# Altium project PT-PWR-EPS-002_v1.PrjPcb (part 3 of 5)

## Sheet [03] - CONNECTORS.SchDoc
size A4; DocumentNumber: 3; SheetNumber: 3; SheetTotal: 12
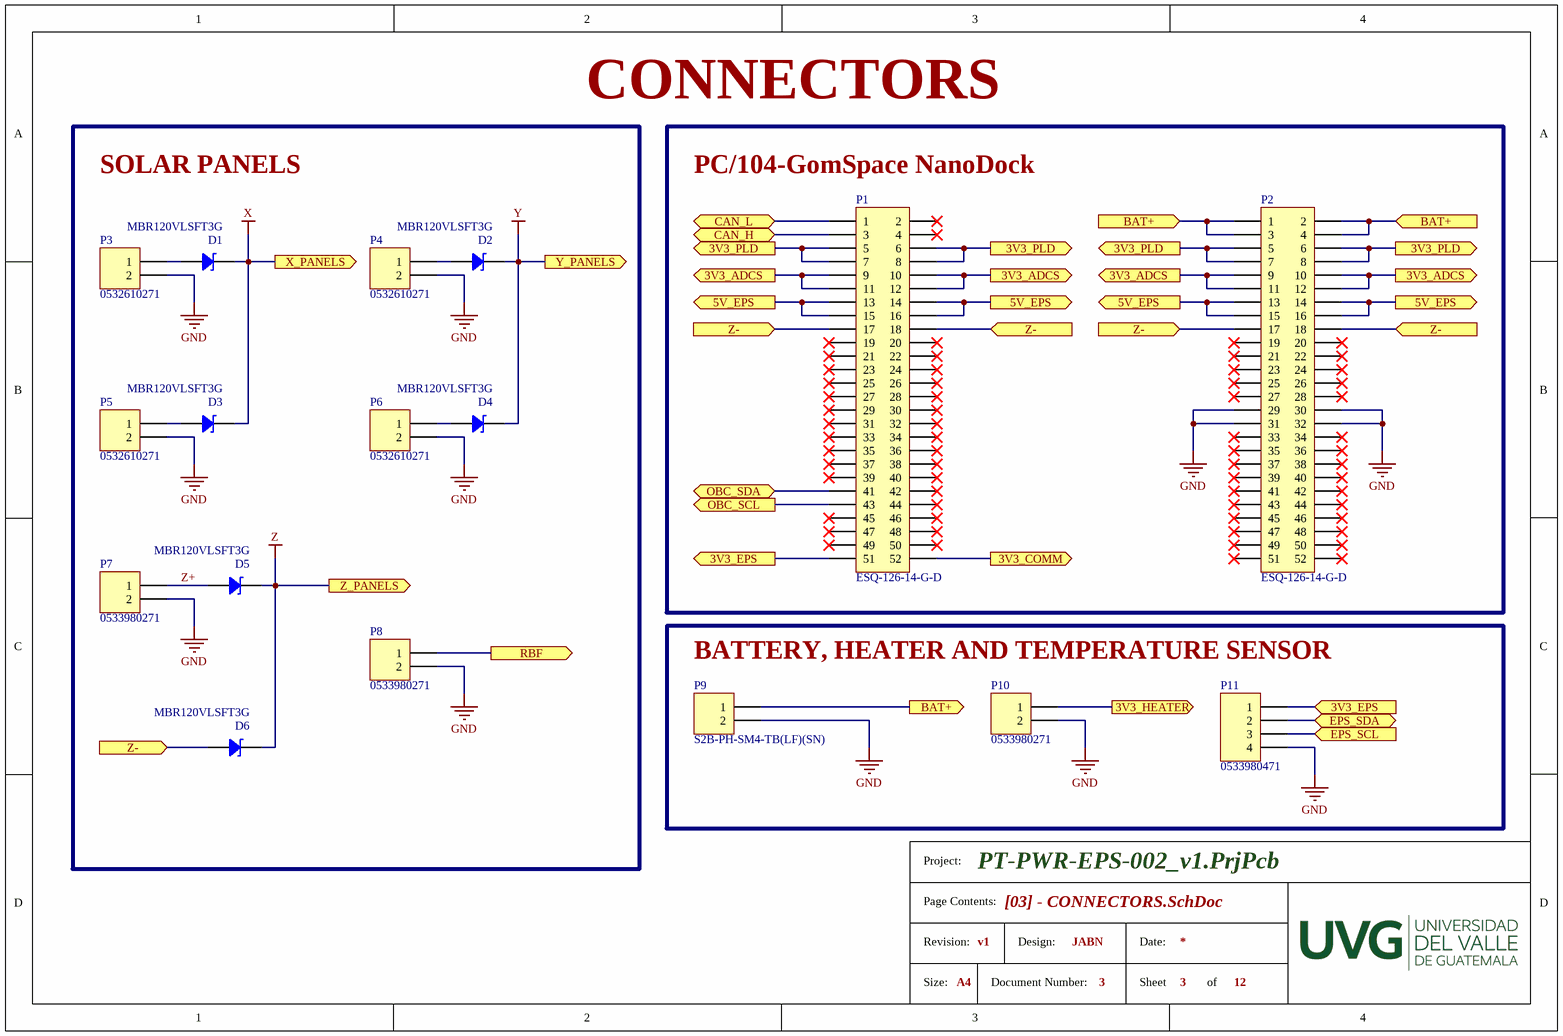
[diagram p5: [03] - CONNECTORS.SchDoc]

### Parts
D1  MBR120VLSFT3G  [SOD123F]
D2  MBR120VLSFT3G  [SOD123F]
D3  MBR120VLSFT3G  [SOD123F]
D4  MBR120VLSFT3G  [SOD123F]
D5  MBR120VLSFT3G  [SOD123F]
D6  MBR120VLSFT3G  [SOD123F]
P1  ESQ-126-14-G-D  [ESQ-126-14-G-D]
P2  ESQ-126-14-G-D  [ESQ-126-14-G-D]
P3  0532610271  [0532610271]
P4  0532610271  [0532610271]
P5  0532610271  [0532610271]
P6  0532610271  [0532610271]
P7  0533980271  [0533980271]
P8  0533980271  [0533980271]
P9  S2B-PH-SM4-TB(LF)(SN)  [S2B-PH-SM4-TB(LF)(SN)]
P10  0533980271  [0533980271]
P11  0533980471  [0533980471]

### Blocks framed on the sheet
CONNECTORS: D1-D6 P3-P8
PC/104-GomSpace NanoDock: P1 P2
BATTERY, HEATER AND TEMPERATURE SENSOR: P9-P11

### Ports
3V3_ADCS (out), 3V3_COMM (out), 3V3_EPS (in), 3V3_EPS (out), 3V3_HEATER (out), 3V3_PLD (out), 5V_EPS (out), BAT+ (in), BAT+ (out), CAN_H (bidir), CAN_L (bidir), EPS_SCL (in), EPS_SDA (bidir), OBC_SCL (out), OBC_SDA (bidir), RBF (out), X_PANELS (out), Y_PANELS (out), Z- (in), Z_PANELS (out)

### Nets
3V3_EPS: P1.51 P11.1 ; port 3V3_EPS
GND: P2.29 P2.30 P2.31 P2.32 P3.2 P4.2 P5.2 P6.2 P7.2 P8.2 P9.2 P10.2 P11.4
X: D1.2 D3.2 ; port X_PANELS
Y: D2.2 D4.2 ; port Y_PANELS
Z: D5.2 D6.2 ; port Z_PANELS
Z+: D5.1 P7.1
NetC22_2: P2.1 P2.2 P2.3 P2.4 P9.1 ; port BAT+
NetC38_2: P1.13 P1.14 P1.15 P1.16 P2.13 P2.14 P2.15 P2.16 ; port 5V_EPS
NetD1_1: D1.1 P3.1
NetD2_1: D2.1 P4.1
NetD3_1: D3.1 P5.1
NetD4_1: D4.1 P6.1
NetD6_1: D6.1 P1.17 P1.18 P2.17 P2.18 ; port Z-
NetP1_1: P1.1 ; port CAN_L
NetP1_3: P1.3 ; port CAN_H
NetP1_5: P1.5 P1.6 P1.7 P1.8 P2.5 P2.6 P2.7 P2.8 ; port 3V3_PLD
NetP1_9: P1.9 P1.10 P1.11 P1.12 P2.9 P2.10 P2.11 P2.12 ; port 3V3_ADCS
NetP1_41: P1.41 ; port OBC_SDA
NetP1_43: P1.43 ; port OBC_SCL
NetP1_52: P1.52 ; port 3V3_COMM
NetP8_1: P8.1 ; port RBF
NetP10_1: P10.1 ; port 3V3_HEATER
NetP11_2: P11.2 ; port EPS_SDA
NetP11_3: P11.3 ; port EPS_SCL

Not connected (* = marked no-connect by the designer): P1 2* 4* 19* 20* 21* 22* 23* 24* 25* 26* 27* 28* 29* 30* 31* 32* 33* 34* 35* 36* 37* 38* 39* 40* 42* 44* 45* 46* 47* 48* 49* 50*; P2 19* 20* 21* 22* 23* 24* 25* 26* 27* 28* 33* 34* 35* 36* 37* 38* 39* 40* 41* 42* 43* 44* 45* 46* 47* 48* 49* 50* 51* 52*

### Notes on the sheet
- SOLAR PANELS
- Project:
- Page Contents:
- Size:
- Revision:
- A4
- Document Number:
- Design:
- Date:
- Sheet
- of

### Library data of the parts
D1-D6 = MBR120VLSFT3G: DIODE SCHOTTKY 20V 1A SOD123FL; Manufacturer: ON Semiconductor; PCN Design/Specification: SOD123-FL Package Height 13/Sep/2013; Voltage - Forward (Vf) (Max) @ If: 340mV @ 1A; Speed: Fast Recovery =  200mA (Io); Current - Reverse Leakage @ Vr: 600µA @ 20V; Online Catalog: Schottky Diode; Other Names: MBR120VLSFT3GOSDKR; Supplier 1: Digi-Key; Manufacturer Part Number: MBR120VLSFT3G; Stock 1: 5944; Pricing 1: 1=0.42, 10=0.338, 100=0.2298, 500=0.1723, 1000=0.1293 (USD); Standard Package: 1; Category: Discrete Semiconductor Products; Family: Diodes, Rectifiers - Single; Series: -; Packaging: Digi-Reel®; Diode Type: Schottky; Voltage - DC Reverse (Vr) (Max): 20V; Current - Average Rectified (Io): 1A; Reverse Recovery Time (trr): -; Capacitance @ Vr, F: -; Mounting Type: Surface Mount; Package / Case: SOD-123F; Supplier Device Package: SOD-123FL; Operating Temperature - Junction: -65°C ~ 125°C; ComponentLink1URL: https://datasheet.ciiva.com/4715/mbr120vlsft1-d-107081-4715104.pdf; ComponentLink1Description: https://datasheet.ciiva.com/4715/mbr120vlsft1-d-107081-4715104.pdf; ComponentLink2URL: https://datasheet.ciiva.com/6380/mbr120vlsft1-d-6380907.pdf; ComponentLink2Description: https://datasheet.ciiva.com/6380/mbr120vlsft1-d-6380907.pdf; ComponentLink3URL: https://datasheet.ciiva.com/8294/mbr120vlsft1-d-8294603.pdf; ComponentLink3Description: https://datasheet.ciiva.com/8294/mbr120vlsft1-d-8294603.pdf; ComponentLink4URL: https://datasheet.ciiva.com/6380/mbr120vlsft1-d-6380910.pdf; ComponentLink4Description: https://datasheet.ciiva.com/6380/mbr120vlsft1-d-6380910.pdf; Supplier Part Number 1: MBR120VLSFT3GOSCT-ND
P1 P2 = ESQ-126-14-G-D: CONN SOCKET 52POS 0.1 GOLD PCB; Manufacturer: Samtec; Number of Contacts: 52; Gender: Receptacle; Max Current Rating: 6.9A; Contact Resistance: 10mR; Max Voltage Rating (AC): 550V; Pitch: 2.54mm; Supplier 1: Digi-Key; Manufacturer Part Number: ESQ-126-14-G-D; Stock 1: 520; Pricing 1: 1 = 9.64000, 10 = 8.91700, 100 = 7.47100, 500 = 6.26600, 1000 = 6.02500 (USD); RoHS: Yes; Contact Plating: Gold; Contact Material: Bronze; Housing Color: Black; Housing Material: Polyester; Min Operating Temperature: -55°C; Max Operating Temperature: 125°C; Number of Rows: 2; Termination: Solder; Packaging: Bulk; Orientation: Straight; Length: 66.55mm; Lead Pitch: 2.54mm; Depth: 4.95mm; Radiation Hardening: No; REACH SVHC: No SVHC; ComponentLink1URL: http://www.farnell.com/datasheets/1902536.pdf?src-supplier=Farnell; ComponentLink1Description: http://www.farnell.com/datasheets/1902536.pdf?src-supplier=Farnell; ComponentLink2URL: http://components.arrow.com/part/dataview/0323_04347871?src-supplier=Arrow+Europe; ComponentLink2Description: http://components.arrow.com/part/dataview/0323_04347871?src-supplier=Arrow+Europe; ComponentLink3URL: http://www.samtec.com/documents/webfiles/pdf/ESW_TH.PDF?src-supplier=Avnet+Europe; ComponentLink3Description: http://www.samtec.com/documents/webfiles/pdf/ESW_TH.PDF?src-supplier=Avnet+Europe; ComponentLink4URL: http://cloud.samtec.com/catalog_english/ESW_TH.PDF?src-supplier=Avnet; ComponentLink4Description: http://cloud.samtec.com/catalog_english/ESW_TH.PDF?src-supplier=Avnet; ComponentLink5URL: http://suddendocs.samtec.com/prints/esq-1xx-xx-x-x-xxx-xx-x-xx-mkt.pdf?src-supplier=Digi-Key; ComponentLink5Description: http://suddendocs.samtec.com/prints/esq-1xx-xx-x-x-xxx-xx-x-xx-mkt.pdf?src-supplier=Digi-Key; ComponentLink6URL: http://www.farnell.com/datasheets/1902536.pdf?src-supplier=Element14; ComponentLink6Description: http://www.farnell.com/datasheets/1902536.pdf?src-supplier=Element14; Supplier Part Number 1: SAM11114-ND
P3-P6 = 0532610271: CONN HEADER 2POS 1.25MM R/A SMD; Manufacturer: Molex; Manufacturer Part Number: 53261-0271; Voltage Rating: 125V; Gender: Male; Contact Resistance: 20mR; Current Rating: 1A; Number of Positions: 2; Insulation Resistance: 100MR; Glow Wire Compliant: Non-compliant; Supplier 1: Digi-Key; Stock 1: 34859; Pricing 1: 1 = 0.98000, 10 = 0.86000, 100 = 0.74170, 500 = 0.60688 (USD); RoHS: Yes; Mount: Surface Mount; Contact Material: Bronze; Contact Plating: Tin; Color: Beige; Housing Material: Thermoplastic; Min Operating Temperature: -40°C; Max Operating Temperature: 85°C; Packaging: Tape and Reel; Termination: SMD/SMT; Package Quantity: 1000; Number of Rows: 1; Number of Contacts: 2; Orientation: Right Angle; Voltage Rating (AC): 125V; Working Voltage: 125V; Number of Circuits: 2; Voltage Rating (DC): 125V; Pitch: 1.25mm; Lead Pitch: 1.25mm; Radiation Hardening: No; REACH SVHC: Unknown; Lead Free: Lead Free; Flammability Rating: UL94 V-0; ComponentLink1URL: https://datasheet.ciiva.com/11747/0900766b8078fc90-11747475.pdf?src-supplier=RSComponents; ComponentLink1Description: https://datasheet.ciiva.com/11747/0900766b8078fc90-11747475.pdf?src-supplier=RSComponents; ComponentLink2URL: https://datasheet.ciiva.com/5151/0532610271-pcb-headers-171053-5151611.pdf?src-supplier=Mouser; ComponentLink2Description: https://datasheet.ciiva.com/5151/0532610271-pcb-headers-171053-5151611.pdf?src-supplier=Mouser; ComponentLink3URL: https://datasheet.ciiva.com/7167/1626147-7167496.pdf?src-supplier=Newark; ComponentLink3Description: https://datasheet.ciiva.com/7167/1626147-7167496.pdf?src-supplier=Newark; ComponentLink4URL: https://datasheet.ciiva.com/30193/198270532610271-pcb-headers-30193321.pdf?src-supplier=Onlinecomponents.com; ComponentLink4Description: https://datasheet.ciiva.com/30193/198270532610271-pcb-headers-30193321.pdf?src-supplier=Onlinecomponents.com; ComponentLink5URL: https://datasheet.ciiva.com/34303/1932547-34303342.pdf?src-supplier=Jameco; ComponentLink5Description: https://datasheet.ciiva.com/34303/1932547-34303342.pdf?src-supplier=Jameco; ComponentLink6URL: https://datasheet.ciiva.com/16658/0532610271-pcb-headers-16658423.pdf?src-supplier=Avnet+Europe; ComponentLink6Description: https://datasheet.ciiva.com/16658/0532610271-pcb-headers-16658423.pdf?src-supplier=Avnet+Europe; ComponentLink7URL: https://datasheet.ciiva.com/17035/70091115-17035863.pdf?src-supplier=Allied+Electronics; ComponentLink7Description: https://datasheet.ciiva.com/17035/70091115-17035863.pdf?src-supplier=Allied+Electronics; ComponentLink8URL: https://datasheet.ciiva.com/46393/1808526-46393547.pdf?src-supplier=Element14; ComponentLink8Description: https://datasheet.ciiva.com/46393/1808526-46393547.pdf?src-supplier=Element14; ComponentLink9URL: https://datasheet.ciiva.com/7920/1887027-7920826.pdf?src-supplier=Element14; ComponentLink9Description: https://datasheet.ciiva.com/7920/1887027-7920826.pdf?src-supplier=Element14; ComponentLink10URL: https://datasheet.ciiva.com/9468/0532610271-pcb-headers-9468506.pdf?src-supplier=Avnet; ComponentLink10Description: https://datasheet.ciiva.com/9468/0532610271-pcb-headers-9468506.pdf?src-supplier=Avnet; ComponentLink11URL: https://datasheet.ciiva.com/22683/1626147-22683562.pdf?src-supplier=Element14; ComponentLink11Description: https://datasheet.ciiva.com/22683/1626147-22683562.pdf?src-supplier=Element14; Supplier Part Number 1: WM7620CT-ND
P7 P8 P10 = 0533980271: CONN HEADER 2POS 1.25MM VERT SMD; Manufacturer: Molex; Connector Type: Header, Shrouded; Number of Positions: 2; Number of Positions Loaded: All; Pitch: 0.049" (1.25mm); Supplier 1: Digi-Key; Manufacturer Part Number: 0533980271; Stock 1: 25214; Pricing 1: 1=0.88, 10=0.778, 100=0.6713, 500=0.5493 (USD); Category: Connectors, Interconnects; Family: Rectangular Connectors - Headers, Male Pins; Series: PicoBlade™ 53398; Packaging: Cut Tape (CT); Contact Type: Blade Pin; Number of Rows: 1; Row Spacing: -; Contact Mating Length: -; Mounting Type: Surface Mount; Termination: Solder; Fastening Type: -; Features: Solder Retention; Contact Finish: Tin; Contact Finish Thickness: 39µin (1.00µm); Color: Natural; ComponentLink1URL: https://datasheet.ciiva.com/6813/533980271-sd-6813860.pdf; ComponentLink1Description: https://datasheet.ciiva.com/6813/533980271-sd-6813860.pdf; ComponentLink2URL: https://datasheet.ciiva.com/3117/0533980271-pcb-headers-3117624.pdf; ComponentLink2Description: https://datasheet.ciiva.com/3117/0533980271-pcb-headers-3117624.pdf; ComponentLink3URL: https://datasheet.ciiva.com/3117/0533980271-pcb-headers-3117625.pdf; ComponentLink3Description: https://datasheet.ciiva.com/3117/0533980271-pcb-headers-3117625.pdf; ComponentLink4URL: https://datasheet.ciiva.com/6813/533980271-sd-6813869.pdf; ComponentLink4Description: https://datasheet.ciiva.com/6813/533980271-sd-6813869.pdf; Supplier Part Number 1: WM7606CT-ND
P9 = S2B-PH-SM4-TB(LF)(SN): CONN HEADER PH SIDE 2POS 2MM SMD; Manufacturer: JST; No of Positions: 2; Style/Orientation: Right Angle Header/Plug; Supplier 1: Digi-Key; Manufacturer Part Number: S2B-PH-SM4-TB(LF)(SN); Stock 1: 113530; Pricing 1: 1=0.58, 10=0.547, 100=0.4194, 500=0.3647 (USD); Pitch: 2 mm; Type: Shrouded Header; Termination: Crimp; ComponentLink1URL: https://datasheet.ciiva.com/11747/0900766b80df0d9d-11747104.pdf; ComponentLink1Description: https://datasheet.ciiva.com/11747/0900766b80df0d9d-11747104.pdf; ComponentLink2URL: https://datasheet.ciiva.com/712/eph-712514.pdf; ComponentLink2Description: https://datasheet.ciiva.com/712/eph-712514.pdf; ComponentLink3URL: https://datasheet.ciiva.com/712/eph-712515.pdf; ComponentLink3Description: https://datasheet.ciiva.com/712/eph-712515.pdf; ComponentLink4URL: https://datasheet.ciiva.com/712/eph-712516.pdf; ComponentLink4Description: https://datasheet.ciiva.com/712/eph-712516.pdf; ComponentLink5URL: https://datasheet.ciiva.com/16199/s2b-ph-sm4-tblfsn-16199686.pdf; ComponentLink5Description: https://datasheet.ciiva.com/16199/s2b-ph-sm4-tblfsn-16199686.pdf; ComponentLink6URL: https://datasheet.ciiva.com/26894/getdatasheetpartid-406256-26894907.pdf; ComponentLink6Description: https://datasheet.ciiva.com/26894/getdatasheetpartid-406256-26894907.pdf; Supplier Part Number 1: 455-1749-1-ND
P11 = 0533980471: CONN HEADER 4POS 1.25MM VERT SMD; Manufacturer: Molex; Manufacturer Part Number: 53398-0471; Body Plating: Tin; Gender: Male; Current Rating: 1A; Voltage Rating: 125V; Number of Positions: 4; Contact Resistance: 20mR; Insulation Resistance: 100MR; Glow Wire Compliant: Non-compliant; Supplier 1: Digi-Key; Stock 1: 49208; Pricing 1: 1=1.19, 10=1.044, 100=0.901, 500=0.73716 (USD); Mount: Surface Mount; Colour: Natural; Housing Colour: Natural; Housing Material: Nylon; Contact Plating: Tin; Contact Material: Bronze,Brass,Tin; Min Operating Temperature: -40°C; Max Operating Temperature: 85°C; Packaging: Tape and Reel; Termination: Solder; Number of Rows: 1; Package Quantity: 1000; Number of Contacts: 4; Orientation: Vertical; Voltage Rating (AC): 125V; Working Voltage: 125V; Number of Circuits: 4; Voltage Rating (DC): 125V; Pitch: 1.25mm; Lead Pitch: 1.25mm; Radiation Hardening: No; REACH SVHC: Unknown; Lead Free: Lead Free; Flammability Rating: UL94 V-0; ComponentLink1URL: https://datasheet.ciiva.com/5154/0533980471-pcb-headers-171069-5154864.pdf; ComponentLink1Description: https://datasheet.ciiva.com/5154/0533980471-pcb-headers-171069-5154864.pdf; ComponentLink2URL: https://datasheet.ciiva.com/39121/1932627-39121616.pdf; ComponentLink2Description: https://datasheet.ciiva.com/39121/1932627-39121616.pdf; ComponentLink3URL: https://datasheet.ciiva.com/23964/0533980471-pcb-headers-23964130.pdf; ComponentLink3Description: https://datasheet.ciiva.com/23964/0533980471-pcb-headers-23964130.pdf; ComponentLink4URL: https://datasheet.ciiva.com/14156/gf116833-116846-e-14156245.pdf; ComponentLink4Description: https://datasheet.ciiva.com/14156/gf116833-116846-e-14156245.pdf; ComponentLink5URL: https://datasheet.ciiva.com/28592/0533980471-pcb-headers-28592022.pdf; ComponentLink5Description: https://datasheet.ciiva.com/28592/0533980471-pcb-headers-28592022.pdf; ComponentLink6URL: https://datasheet.ciiva.com/22700/1841151-22700615.pdf; ComponentLink6Description: https://datasheet.ciiva.com/22700/1841151-22700615.pdf; ComponentLink7URL: https://datasheet.ciiva.com/30178/225160533980471-pcb-headers-30178167.pdf; ComponentLink7Description: https://datasheet.ciiva.com/30178/225160533980471-pcb-headers-30178167.pdf; ComponentLink8URL: https://datasheet.ciiva.com/11748/0900766b80ab946a-11748472.pdf; ComponentLink8Description: https://datasheet.ciiva.com/11748/0900766b80ab946a-11748472.pdf; ComponentLink9URL: https://datasheet.ciiva.com/31408/0533980471-pcb-headers-31408393.pdf; ComponentLink9Description: https://datasheet.ciiva.com/31408/0533980471-pcb-headers-31408393.pdf; ComponentLink10URL: https://datasheet.ciiva.com/46384/1788582-46384012.pdf; ComponentLink10Description: https://datasheet.ciiva.com/46384/1788582-46384012.pdf; ComponentLink11URL: https://datasheet.ciiva.com/9468/0533980471-pcb-headers-9468286.pdf; ComponentLink11Description: https://datasheet.ciiva.com/9468/0533980471-pcb-headers-9468286.pdf; ComponentLink12URL: https://datasheet.ciiva.com/16658/0533980471-pcb-headers-16658431.pdf; ComponentLink12Description: https://datasheet.ciiva.com/16658/0533980471-pcb-headers-16658431.pdf; Supplier Part Number 1: WM7608CT-ND

## Sheet [05] - ENERGY STORAGE AND PROTECTION.SchDoc
size A4; DocumentNumber: 5; SheetNumber: 5; SheetTotal: 12; PageSetup: Record=PageOptions|CenterHorizontal=True|CenterVertical=True|PrintScale=0.73|XCorrection=1.00|YCorrection=1.00|PrintKind=0|BorderSize=5000000|LeftOffset=0|BottomOffset=0|Orientation=2|PaperLength=1000|PaperWidth=1000|Scale=100|PaperSource=7|PrintQuality=-3|MediaType=1|DitherType=10|PrintScaleMode=1|PaperKind=A3|PaperIndex=8
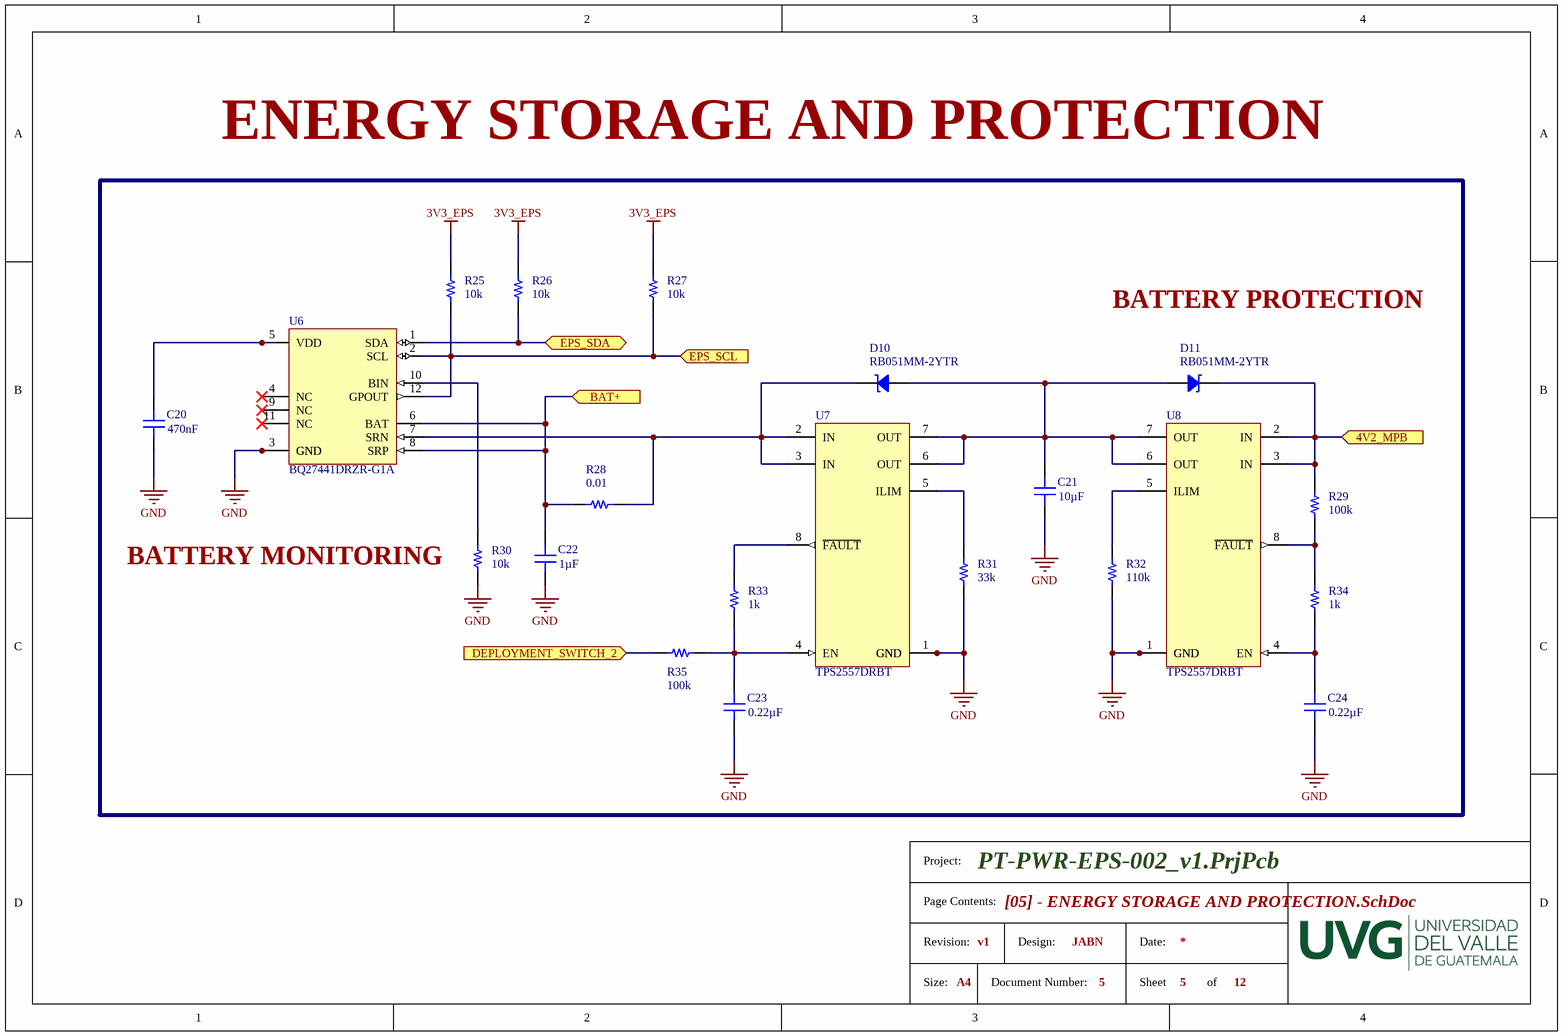
[diagram p6: [05] - ENERGY STORAGE AND PROTECTION.SchDoc]

### Parts
C20  Capacitance: 470nF  [RES 0603/1608]  (hidden comment: CL10B474KA8NFNC)
C21  Capacitance: 10µF  [CAP 0603/1608]  (hidden comment: CL10A106MQ8NNNC)
C22  Capacitance: 1µF  [CAP 0603/1608]  (hidden comment: CL10A105KP8NNNC)
C23  EMK107B7224KA-T  [CAP 0603/1608]  (value not drawn)
C24  EMK107B7224KA-T  [CAP 0603/1608]  (value not drawn)
D10  RB051MM-2YTR  [SOD123F]
D11  RB051MM-2YTR  [SOD123F]
R25  Resistance: 10k  [RES 0603/1608]  (hidden comment: RNCP0603FTD10K0)
R26  Resistance: 10k  [RES 0603/1608]  (hidden comment: RNCP0603FTD10K0)
R27  Resistance: 10k  [RES 0603/1608]  (hidden comment: RNCP0603FTD10K0)
R28  Resistance: 0.01  [STACKPOLE CSR2010]  (hidden comment: CSRN2010FK10L0)
R29  Resistance: 100k  [RES 0603/1608]  (hidden comment: CR0603-JW-104ELF)
R30  Resistance: 10k  [RES 0603/1608]  (hidden comment: RNCP0603FTD10K0)
R31  CRGCQ0603F33K  [RES 0603/1608]  (value not drawn)
R32  Resistance: 110k  [RES 0603/1608]  (hidden comment: RC0603FR-07110KL)
R33  Resistance: 1k  [RES 0603/1608]  (hidden comment: ESR03EZPJ102)
R34  Resistance: 1k  [RES 0603/1608]  (hidden comment: ESR03EZPJ102)
R35  Resistance: 100k  [RES 0603/1608]  (hidden comment: CR0603-JW-104ELF)
U6  BQ27441DRZR-G1A  [12-VFDFN]
U7  TPS2557DRBT  [8-VDFN]
U8  TPS2557DRBT  [8-VDFN]

### Ports
4V2_MPB (in), BAT+ (in), DEPLOYMENT_SWITCH_2 (in), EPS_SCL (in), EPS_SDA (bidir)

### Nets
3V3_EPS: R25.2 R26.2 R27.2
4V2_MPB: D11.2 R29.2 U8.2(IN) U8.3(IN) ; port 4V2_MPB
GND: C20.1 C21.1 C22.1 C23.1 C24.1 R30.1 R31.1 R32.1 U6.3(GND) U6.13(GND) U7.1(GND) U7.9(GND) U8.1(GND) U8.9(GND)
NetC20_2: C20.2 U6.5(VDD)
NetC21_2: C21.2 D10.1 D11.1 U7.6(OUT) U7.7(OUT) U8.6(OUT) U8.7(OUT)
NetC22_2: C22.2 R28.2 U6.6(BAT) U6.8(SRP) ; port BAT+
NetC23_2: C23.2 R33.1 R35.2 U7.4(EN)
NetC24_2: C24.2 R34.1 U8.4(EN)
NetC62_2: R35.1 ; port DEPLOYMENT_SWITCH_2
NetD10_2: D10.2 R28.1 U6.7(SRN) U7.2(IN) U7.3(IN)
NetP11_2: R26.1 U6.1(SDA) ; port EPS_SDA
NetP11_3: R25.1 R27.1 U6.2(SCL) U6.12(GPOUT) ; port EPS_SCL
NetR29_1: R29.1 R34.2 U8.8(~{FAULT})
NetR30_2: R30.2 U6.10(BIN)
NetR31_2: R31.2 U7.5(ILIM)
NetR32_2: R32.2 U8.5(ILIM)
NetR33_2: R33.2 U7.8(~{FAULT})

Not connected (* = marked no-connect by the designer): U6 4(NC)* 9(NC)* 11(NC)*

### Notes on the sheet
- ENERGY STORAGE AND PROTECTION
- BATTERY PROTECTION
- BATTERY MONITORING
- (near R31) 33k
- (near C23) 0.22µF
- (near C24) 0.22µF
- Project:
- Page Contents:
- Size:
- Revision:
- A4
- Document Number:
- Design:
- Date:
- Sheet
- of

### Library data of the parts
C20 = CL10B474KA8NFNC: CAP CER 0.47UF 25V X7R 0603; Manufacturer: Samsung; Tolerance: 10%; Supplier 1: Digi-Key; Manufacturer Part Number: CL10B474KA8NFNC; Stock 1: 469116; Pricing 1: 1 = 0.10000, 10 = 0.07300, 100 = 0.03450, 500 = 0.02422, 1000 = 0.02005 (USD); RoHS: Yes; Mount: Surface Mount; Case/Package: 0603; Case Code (Metric): 1608; Case Code (Imperial): 0603; Min Operating Temperature: -55°C; Max Operating Temperature: 125°C; Package Quantity: 1; Packaging: Tape and Reel; Voltage Rating: 25V; Dielectric: X7R; Length: 0.063inch; Height: 0.8mm; Width: 0.031inch; Thickness: 0.035inch; Depth: 0.8mm; Radiation Hardening: No; Lead Free: Lead Free; ComponentLink1URL: https://datasheet.ciiva.com/25777/cl10b474ka8nfnc-25777510.pdf?src-supplier=Digi-Key; ComponentLink1Description: https://datasheet.ciiva.com/25777/cl10b474ka8nfnc-25777510.pdf?src-supplier=Digi-Key; ComponentLink2URL: https://datasheet.ciiva.com/16428/cl10b474ka8nfnc-16428839.pdf?src-supplier=Future+Electronics; ComponentLink2Description: https://datasheet.ciiva.com/16428/cl10b474ka8nfnc-16428839.pdf?src-supplier=Future+Electronics; Supplier Part Number 1: 1276-2082-1-ND
C21 = CL10A106MQ8NNNC: CAP CER 10UF 6.3V X5R 0603; Manufacturer: Samsung; Tolerance: 20%; Supplier 1: Digi-Key; Manufacturer Part Number: CL10A106MQ8NNNC; Stock 1: 3866590; Pricing 1: 1 = 0.15000, 10 = 0.11000, 100 = 0.05150, 500 = 0.03614, 1000 = 0.02992 (USD); RoHS: Yes; Mount: Surface Mount; Case/Package: 0603; Case Code (Metric): 1608; Case Code (Imperial): 0603; Contact Plating: Tin; Min Operating Temperature: -55°C; Max Operating Temperature: 85°C; Package Quantity: 1; Packaging: Tape and Reel; Voltage Rating: 6.3V; Dielectric: X5R; Voltage: 6.3V; Length: 1.6mm; Height: 0.8mm; Width: 0.031inch; Thickness: 0.035inch; Depth: 0.8mm; Radiation Hardening: No; ComponentLink1URL: https://datasheet.ciiva.com/25798/cl10a106mq8nnnc-25798320.pdf?src-supplier=Digi-Key; ComponentLink1Description: https://datasheet.ciiva.com/25798/cl10a106mq8nnnc-25798320.pdf?src-supplier=Digi-Key; ComponentLink2URL: https://datasheet.ciiva.com/26838/getdatasheetpartid-357557-26838347.pdf?src-supplier=Verical; ComponentLink2Description: https://datasheet.ciiva.com/26838/getdatasheetpartid-357557-26838347.pdf?src-supplier=Verical; ComponentLink3URL: https://datasheet.ciiva.com/16437/cl05b104kq5nnnc-16437327.pdf?src-supplier=Future+Electronics; ComponentLink3Description: https://datasheet.ciiva.com/16437/cl05b104kq5nnnc-16437327.pdf?src-supplier=Future+Electronics; Supplier Part Number 1: 1276-1119-1-ND
C22 = CL10A105KP8NNNC: CAP CER 1UF 10V X5R 0603; Manufacturer: Samsung; Tolerance: 10%; Supplier 1: Digi-Key; Manufacturer Part Number: CL10A105KP8NNNC; Stock 1: 4411775; Pricing 1: 1 = 0.10000, 10 = 0.03800, 100 = 0.01680, 500 = 0.01200, 1000 = 0.00943 (USD); RoHS: Yes; Mount: Surface Mount; Case/Package: 0603; Case Code (Metric): 1608; Case Code (Imperial): 0603; Contact Plating: Tin; Min Operating Temperature: -55°C; Max Operating Temperature: 85°C; Packaging: Tape and Reel; Package Quantity: 1; Voltage Rating: 10V; Dielectric: X5R; Voltage: 10V; Length: 1.6mm; Height: 0.8mm; Width: 0.031inch; Thickness: 0.035inch; Depth: 0.8mm; Radiation Hardening: No; ComponentLink1URL: https://datasheet.ciiva.com/15195/getdatasheetpartid-358616-15195708.pdf?src-supplier=Verical; ComponentLink1Description: https://datasheet.ciiva.com/15195/getdatasheetpartid-358616-15195708.pdf?src-supplier=Verical; ComponentLink2URL: https://datasheet.ciiva.com/16358/cl05b104kq5nnnc-16358431.pdf?src-supplier=Future+Electronics; ComponentLink2Description: https://datasheet.ciiva.com/16358/cl05b104kq5nnnc-16358431.pdf?src-supplier=Future+Electronics; Supplier Part Number 1: 1276-1182-1-ND
C23 C24 = EMK107B7224KA-T: CAP CER 0.22UF 16V X7R 0603
D10 D11 = RB051MM-2YTR: DIODE SCHOTTKY 20V 3A PMDU; Manufacturer: Rohm; Supplier 1: Digi-Key; Manufacturer Part Number: RB051MM-2YTR; Stock 1: 1333; Pricing 1: 1 = 0.49000, 10 = 0.41700, 100 = 0.31150, 500 = 0.24472, 1000 = 0.18911 (USD); Mount: Surface Mount; Packaging: Tape and Reel; Average Rectified Current: 3A; Max Reverse Voltage (DC): 20V; ComponentLink1URL: http://www.mouser.com/ds/2/348/rb051mm-2y-e-1017157.pdf?src-supplier=Mouser; ComponentLink1Description: http://www.mouser.com/ds/2/348/rb051mm-2y-e-1017157.pdf?src-supplier=Mouser; ComponentLink2URL: http://www.rohm.com/web/global/datasheet/RB051MM-2Y/rb051mm-2y-e?src-supplier=Digi-Key; ComponentLink2Description: http://www.rohm.com/web/global/datasheet/RB051MM-2Y/rb051mm-2y-e?src-supplier=Digi-Key; ComponentLink3URL: http://rohmfs.rohm.com/en/techdata_basic/diode/taping/Taping_PMDU(M)_TR-e.pdf?src-supplier=Digi-Key; ComponentLink3Description: http://rohmfs.rohm.com/en/techdata_basic/diode/taping/Taping_PMDU(M)_TR-e.pdf?src-supplier=Digi-Key; Supplier Part Number 1: RB051MM-2YCT-ND
R25-R27 R30 = RNCP0603FTD10K0: RES SMD 10K OHM 1% 1/8W 0603; Manufacturer: Stackpole Electronics; Max Power Dissipation: 125mW; Temperature Coefficient: 100ppm/°C; Supplier 1: Digi-Key; Manufacturer Part Number: RNCP0603FTD10K0; Stock 1: 579582; Pricing 1: 1 = 0.10000, 10 = 0.06700, 100 = 0.02730, 1000 = 0.01224, 2500 = 0.01063 (USD); RoHS: Yes; Mount: Surface Mount; Case/Package: 0603; Case Code (Metric): 1608; Case Code (Imperial): 0603; Contact Plating: Tin; Min Operating Temperature: -55°C; Max Operating Temperature: 155°C; Packaging: Tape and Reel; Tolerance: 1%; Composition: Thin Film; Number of Terminations: 2; Features: Moisture Resistant; Length: 0.059inch; Height: 0.02inch; Width: 0.031inch; Radiation Hardening: No; Lead Free: Lead Free; ComponentLink1URL: https://www.seielect.com/Catalog/SEI-rncp.pdf?src-supplier=Avnet; ComponentLink1Description: https://www.seielect.com/Catalog/SEI-rncp.pdf?src-supplier=Avnet; ComponentLink2URL: https://www.seielect.com/catalog/SEI-Packaging.pdf?src-supplier=Digi-Key; ComponentLink2Description: https://www.seielect.com/catalog/SEI-Packaging.pdf?src-supplier=Digi-Key; ComponentLink3URL: https://www.seielect.com/Catalog/SEI-rncp.pdf?src-supplier=Digi-Key; ComponentLink3Description: https://www.seielect.com/Catalog/SEI-rncp.pdf?src-supplier=Digi-Key; Supplier Part Number 1: RNCP0603FTD10K0CT-ND
R28 = CSRN2010FK10L0: RES 0.01 OHM 1% 1W 2010; Manufacturer: Stackpole Electronics; Temperature Coefficient: 250ppm/°C; Supplier 1: Digi-Key; Manufacturer Part Number: CSRN2010FK10L0; Stock 1: 15344; Pricing 1: 1=0.58, 10=0.485, 25=0.416, 50=0.3742, 100=0.3257, 250=0.29108, 500=0.23562 (USD); Mount: Surface Mount; Case/Package: 2010; Case Code (Metric): 5025; Case Code (Imperial): 2010; Contact Plating: Matte,Tin; Min Operating Temperature: -55°C; Max Operating Temperature: 155°C; Packaging: Tape and Reel; Tolerance: 1%; Power Rating: 1W; Composition: Thick Film; Number of Terminations: 2; Max Power Dissipation: 1W; Length: 0.197inch; Height: 0.03inch; Width: 0.097inch; Radiation Hardening: No; Supplier Part Number 1: CSRN2010FK10L0DKR-ND
R29 R35 = CR0603-JW-104ELF: RES SMD 100K OHM 5% 1/10W 0603; Manufacturer: Bourns; Power Rating: 100mW; Voltage Rating: 50V; Temperature Coefficient: 200ppm/°C; Supplier 1: Digi-Key; Manufacturer Part Number: CR0603-JW-104ELF; Stock 1: 138181; Pricing 1: 1 = 0.10000, 10 = 0.01500, 25 = 0.01080, 50 = 0.00840, 100 = 0.00610, 250 = 0.00468, 500 = 0.00374, 1000 = 0.00275 (USD); RoHS: Yes; Mount: Surface Mount; Case/Package: 0603; Number of Pins: 2; Case Code (Imperial): 0603; Case Code (Metric): 1608; Contact Plating: Tin; Min Operating Temperature: -55°C; Max Operating Temperature: 155°C; Packaging: Tape and Reel; Tolerance: 5%; Package Quantity: 5000; Composition: Thick Film; Termination: SMD/SMT; Working Voltage: 50V; Military Standard: Not; Voltage Rating (DC): 50V; Length: 1.6mm; Height: 0.45mm; Width: 0.8mm; Depth: 0.8mm; Thickness: 457um; Radiation Hardening: No; REACH SVHC: No SVHC; ComponentLink1URL: https://datasheet.ciiva.com/22713/691949-22713239.pdf?src-supplier=Element14; ComponentLink1Description: https://datasheet.ciiva.com/22713/691949-22713239.pdf?src-supplier=Element14; ComponentLink2URL: https://datasheet.ciiva.com/23776/1902866-23776391.pdf?src-supplier=Newark; ComponentLink2Description: https://datasheet.ciiva.com/23776/1902866-23776391.pdf?src-supplier=Newark; ComponentLink3URL: https://datasheet.ciiva.com/16766/70154685-16766760.pdf?src-supplier=Allied+Electronics; ComponentLink3Description: https://datasheet.ciiva.com/16766/70154685-16766760.pdf?src-supplier=Allied+Electronics; ComponentLink4URL: https://datasheet.ciiva.com/30229/159chpreztr-30229129.pdf?src-supplier=Onlinecomponents.com; ComponentLink4Description: https://datasheet.ciiva.com/30229/159chpreztr-30229129.pdf?src-supplier=Onlinecomponents.com; ComponentLink5URL: https://datasheet.ciiva.com/16935/chpreztr-16935963.pdf?src-supplier=Avnet+Europe; ComponentLink5Description: https://datasheet.ciiva.com/16935/chpreztr-16935963.pdf?src-supplier=Avnet+Europe; ComponentLink6URL: https://datasheet.ciiva.com/5543/chpreztr-5543676.pdf?src-supplier=Mouser; ComponentLink6Description: https://datasheet.ciiva.com/5543/chpreztr-5543676.pdf?src-supplier=Mouser; ComponentLink7URL: https://datasheet.ciiva.com/9120/chpreztr-9120764.pdf?src-supplier=Avnet; ComponentLink7Description: https://datasheet.ciiva.com/9120/chpreztr-9120764.pdf?src-supplier=Avnet; ComponentLink8URL: https://datasheet.ciiva.com/46383/1791942-46383790.pdf?src-supplier=Element14; ComponentLink8Description: https://datasheet.ciiva.com/46383/1791942-46383790.pdf?src-supplier=Element14; ComponentLink9URL: https://datasheet.ciiva.com/48692/001055501-da-01-en-smd-wid-cr0603-jw-104elf-100k-ohm-1-10w-48692133.pdf?src-supplier=Conrad; ComponentLink9Description: https://datasheet.ciiva.com/48692/001055501-da-01-en-smd-wid-cr0603-jw-104elf-100k-ohm-1-10w-48692133.pdf?src-supplier=Conrad; Supplier Part Number 1: CR0603-JW-104ELFCT-ND
R31 = CRGCQ0603F33K: RES SMD 33K OHM 1% 1/10W 0603; Manufacturer: TE Connectivity; Supplier 1: Digi-Key; Manufacturer Part Number: CRGCQ0603F33K; Stock 1: 142729; Pricing 1: 1 = 0.10000, 10 = 0.03100, 100 = 0.01260, 1000 = 0.00568, 2500 = 0.00493 (USD); ComponentLink1URL: http://sigma.octopart.com/114683329/technical_drawing/TE-Connectivity-CRGCQ0603F33K.pdf?src-supplier=TE+Connectivity; ComponentLink1Description: http://sigma.octopart.com/114683329/technical_drawing/TE-Connectivity-CRGCQ0603F33K.pdf?src-supplier=TE+Connectivity; ComponentLink2URL: http://datasheet.octopart.com/CRGCQ0603F33K-TE-Connectivity-datasheet-114679081.pdf?src-supplier=TE+Connectivity; ComponentLink2Description: http://datasheet.octopart.com/CRGCQ0603F33K-TE-Connectivity-datasheet-114679081.pdf?src-supplier=TE+Connectivity; Supplier Part Number 1: A129706CT-ND
R32 = RC0603FR-07110KL: RES SMD 110K OHM 1% 1/10W 0603; Manufacturer: Yageo; Power Rating: 100mW; Voltage Rating: 50V; Temperature Coefficient: 100ppm/°C; Supplier 1: Digi-Key; Manufacturer Part Number: RC0603FR-07110KL; Stock 1: 1846762; Pricing 1: 1=0.1, 10=0.024, 100=0.0097, 1000=0.00437, 2500=0.00379 (USD); Mount: Surface Mount; Case/Package: 0603; Case Code (Metric): 1608; Case Code (Imperial): 0603; Min Operating Temperature: -55°C; Max Operating Temperature: 155°C; Tolerance: 1%; Package Quantity: 1; Packaging: Tape and Reel; Composition: Thick Film; Number of Terminations: 2; Termination: SMD/SMT; Military Standard: Not; Max Power Dissipation: 100mW; Voltage Rating (DC): 50V; Features: Moisture Resistant; Length: 1.6mm; Height: 0.022inch; Width: 0.031inch; Depth: 0.8mm; Lead Free: Lead Free; ComponentLink1URL: http://documents.rs-components.com/techlib://itc_doclist_GB.htm?stockno=5049117&src-supplier=RSComponents; ComponentLink1Description: http://documents.rs-components.com/techlib://itc_doclist_GB.htm?stockno=5049117&src-supplier=RSComponents; ComponentLink2URL: http://www.yageo.com/documents/recent/PYu-RC_Group_51_RoHS_L_10.pdf?src-supplier=Digi-Key; ComponentLink2Description: http://www.yageo.com/documents/recent/PYu-RC_Group_51_RoHS_L_10.pdf?src-supplier=Digi-Key; ComponentLink3URL: https://www.verical.com/server-webapp/html/getDatasheet?partID=324995&src-supplier=Verical; ComponentLink3Description: https://www.verical.com/server-webapp/html/getDatasheet?partID=324995&src-supplier=Verical; ComponentLink4URL: http://www.yageo.com/documents/recent/PYu-RC_Group_51_RoHS_L_9.pdf?src-supplier=Digi-Key; ComponentLink4Description: http://www.yageo.com/documents/recent/PYu-RC_Group_51_RoHS_L_9.pdf?src-supplier=Digi-Key; Supplier Part Number 1: 311-110KHRCT-ND
R33 R34 = ESR03EZPJ102: RES SMD 1K OHM 5% 1/4W 0603; Manufacturer: Rohm; Temperature Coefficient: 200ppm/°C; Max Power Dissipation: 250mW; Supplier 1: Digi-Key; Manufacturer Part Number: ESR03EZPJ102; Stock 1: 187581; Pricing 1: 1 = 0.10000, 10 = 0.08300, 100 = 0.03180, 1000 = 0.01398, 2500 = 0.01207 (USD); RoHS: Yes; Case/Package: 0603; Case Code (Metric): 1608; Case Code (Imperial): 0603; Min Operating Temperature: -55°C; Max Operating Temperature: 155°C; Tolerance: 5%; Package Quantity: 1; Packaging: Tape and Reel; Composition: Thick Film; Number of Terminations: 2; Features: Automotive AEC-Q200; Length: 0.063inch; Height: 0.022inch; Width: 0.031inch; Lead Free: Lead Free; ComponentLink1URL: https://datasheet.ciiva.com/2469/esr-2469603.pdf?src-supplier=Digi-Key; ComponentLink1Description: https://datasheet.ciiva.com/2469/esr-2469603.pdf?src-supplier=Digi-Key; ComponentLink2URL: https://datasheet.ciiva.com/2469/esr-2469604.pdf?src-supplier=Digi-Key; ComponentLink2Description: https://datasheet.ciiva.com/2469/esr-2469604.pdf?src-supplier=Digi-Key; ComponentLink3URL: https://datasheet.ciiva.com/2469/esr-2469605.pdf?src-supplier=Digi-Key; ComponentLink3Description: https://datasheet.ciiva.com/2469/esr-2469605.pdf?src-supplier=Digi-Key; Supplier Part Number 1: RHM1.0KDCT-ND
U6 = BQ27441DRZR-G1A: IC BATT FUEL GAUGE LI-ION 12SON; Manufacturer: Texas Instruments; Number of Cells: 1; Interface: I2C; Capacity: 8000mAh; Output Voltage: 600mV; Output Current: 500uA; Operating Supply Voltage: 4.5V; Supplier 1: Digi-Key; Manufacturer Part Number: BQ27441DRZR-G1A; Stock 1: 11262; Pricing 1: 1=2.62, 10=2.353, 100=1.8911, 500=1.55376, 1000=1.2874 (USD); Mount: Surface Mount; Case/Package: QFN; Number of Pins: 12; Contact Plating: Gold; Min Operating Temperature: -40°C; Max Operating Temperature: 85°C; Package Quantity: 3000; Packaging: Tape and Reel; Lead Free: Lead Free; Supplier Part Number 1: 296-39941-6-ND
U7 U8 = TPS2557DRBT: IC PWR DIST SWITCH ADJ 8SON; Manufacturer: Texas Instruments; Number of Inputs: 1; Max Output Current: 5A; Max Input Voltage: 6.5V; Min Input Voltage: 2.5V; Interface: On/Off; On-State Resistance: 22mR; Turn-Off Delay Time: 6ms; Turn-On Delay Time: 9ms; Power Rating: 2.403W; Power Dissipation: 2.4W; Fault Protection: Over Temperature; Output Configuration: High Side; Supplier 1: Digi-Key; Manufacturer Part Number: TPS2557DRBT; Stock 1: 20726; Pricing 1: 1 = 2.46000, 10 = 2.21100, 100 = 1.77710 (USD); RoHS: Yes; Mount: Surface Mount; Number of Pins: 8; Weight: 0.000847oz; Contact Plating: Gold; Min Operating Temperature: -40°C; Max Operating Temperature: 85°C; Number of Outputs: 1; Packaging: Tape and Reel; Output Current: 5A; Min Supply Voltage: 2.5V; Max Supply Voltage: 6.5V; Package Quantity: 250; Voltage: 6.5V; Current: 5A; Max Power Dissipation: 2.403W; Termination: SMD/SMT; Length: 3.15mm; Height: 0.95mm; Width: 3.15mm; Radiation Hardening: No; REACH SVHC: No SVHC; Lead Free: Lead Free; ComponentLink1URL: https://datasheet.ciiva.com/1572/1788976-1572611.pdf?src-supplier=Digi-Key; ComponentLink1Description: https://datasheet.ciiva.com/1572/1788976-1572611.pdf?src-supplier=Digi-Key; ComponentLink2URL: https://datasheet.ciiva.com/1572/1633920-1572613.pdf?src-supplier=Farnell; ComponentLink2Description: https://datasheet.ciiva.com/1572/1633920-1572613.pdf?src-supplier=Farnell; ComponentLink3URL: https://datasheet.ciiva.com/15113/getdatasheetpartid-224110-15113913.pdf?src-supplier=Verical; ComponentLink3Description: https://datasheet.ciiva.com/15113/getdatasheetpartid-224110-15113913.pdf?src-supplier=Verical; ComponentLink4URL: https://datasheet.ciiva.com/41462/001014733-da-01-en-ic-pwr-dist-switc-tps2557drbt-vson-8-tid-41462584.pdf?src-supplier=Conrad; ComponentLink4Description: https://datasheet.ciiva.com/41462/001014733-da-01-en-ic-pwr-dist-switc-tps2557drbt-vson-8-tid-41462584.pdf?src-supplier=Conrad; ComponentLink5URL: https://datasheet.ciiva.com/26882/tps2557drbt-26882159.pdf?src-supplier=IIIC; ComponentLink5Description: https://datasheet.ciiva.com/26882/tps2557drbt-26882159.pdf?src-supplier=IIIC; ComponentLink6URL: https://datasheet.ciiva.com/1963/tps2557-1963969.pdf?src-supplier=Digi-Key; ComponentLink6Description: https://datasheet.ciiva.com/1963/tps2557-1963969.pdf?src-supplier=Digi-Key; ComponentLink7URL: https://datasheet.ciiva.com/1963/tps2557-1963970.pdf?src-supplier=Digi-Key; ComponentLink7Description: https://datasheet.ciiva.com/1963/tps2557-1963970.pdf?src-supplier=Digi-Key; ComponentLink8URL: https://datasheet.ciiva.com/3216/tps2556-3216885.pdf?src-supplier=Avnet; ComponentLink8Description: https://datasheet.ciiva.com/3216/tps2556-3216885.pdf?src-supplier=Avnet; ComponentLink9URL: https://datasheet.ciiva.com/1512/1788976-1512726.pdf?src-supplier=Element14; ComponentLink9Description: https://datasheet.ciiva.com/1512/1788976-1512726.pdf?src-supplier=Element14; ComponentLink10URL: https://datasheet.ciiva.com/3217/tps2556-3217144.pdf?src-supplier=Avnet; ComponentLink10Description: https://datasheet.ciiva.com/3217/tps2556-3217144.pdf?src-supplier=Avnet; ComponentLink11URL: https://datasheet.ciiva.com/14153/tps2556-2557-eng-ds-14153308.pdf?src-supplier=Distrelec; ComponentLink11Description: https://datasheet.ciiva.com/14153/tps2556-2557-eng-ds-14153308.pdf?src-supplier=Distrelec; ComponentLink12URL: https://datasheet.ciiva.com/26182/tps2556-26182925.pdf?src-supplier=Avnet+Europe; ComponentLink12Description: https://datasheet.ciiva.com/26182/tps2556-26182925.pdf?src-supplier=Avnet+Europe; Supplier Part Number 1: 296-25432-1-ND

## Sheet [10] - DEPLOYMENT SWITCHES AND RBF.SchDoc
size A4; DocumentNumber: 10; SheetNumber: 10; SheetTotal: 12
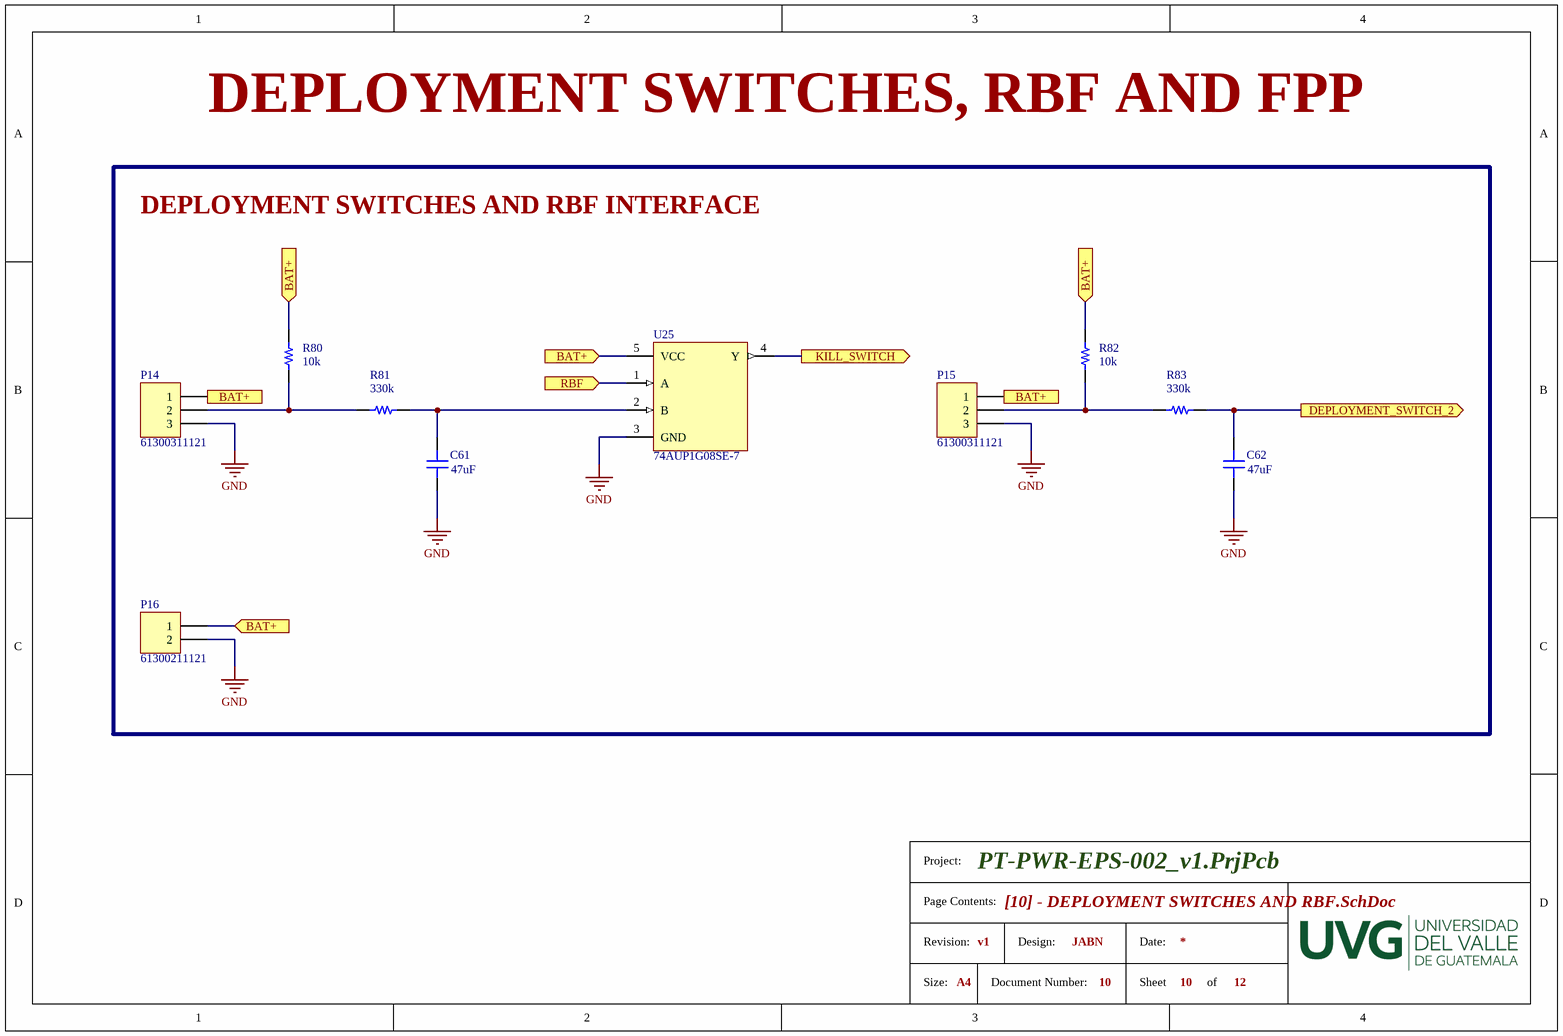
[diagram p7: [10] - DEPLOYMENT SWITCHES AND RBF.SchDoc]

### Parts
C61  Capacitance: 47uF  [CAP 0603/1608]  (hidden comment: GRM188R60E476ME15D)
C62  Capacitance: 47uF  [CAP 0603/1608]  (hidden comment: GRM188R60E476ME15D)
P14  61300311121  [61300311121]
P15  61300311121  [61300311121]
P16  61300211121  [61300211121]
R80  Resistance: 10k  [RES 0603/1608]  (hidden comment: RNCP0603FTD10K0)
R81  CRGCQ0603F330K  [RES 0603/1608]  (value not drawn)
R82  Resistance: 10k  [RES 0603/1608]  (hidden comment: RNCP0603FTD10K0)
R83  CRGCQ0603F330K  [RES 0603/1608]  (value not drawn)
U25  74AUP1G08SE-7  [SOT353-5]

### Ports
BAT+ (in), DEPLOYMENT_SWITCH_2 (out), KILL_SWITCH (out), RBF (in)

### Nets
GND: C61.1 C62.1 P14.3 P15.3 P16.2 U25.3(GND)
NetC22_2: P14.1 P15.1 P16.1 R80.2 R82.2 U25.5(VCC) ; port BAT+
NetC61_2: C61.2 R81.2 U25.2(B)
NetC62_2: C62.2 R83.2 ; port DEPLOYMENT_SWITCH_2
NetP8_1: U25.1(A) ; port RBF
NetP14_2: P14.2 R80.1 R81.1
NetP15_2: P15.2 R82.1 R83.1
NetR42_1: U25.4(Y) ; port KILL_SWITCH

### Notes on the sheet
- DEPLOYMENT SWITCHES, RBF AND FPP
- DEPLOYMENT SWITCHES AND RBF INTERFACE
- (near R81) 330k
- (near R83) 330k
- Project:
- Page Contents:
- Size:
- Revision:
- A4
- Document Number:
- Design:
- Date:
- Sheet
- of

### Library data of the parts
C61 C62 = GRM188R60E476ME15D: CAP CER 47UF 2.5V X5R 0603; Manufacturer: Murata; Tolerance: 20%; Supplier 1: Digi-Key; Manufacturer Part Number: GRM188R60E476ME15D; Stock 1: 21402; Pricing 1: 1 = 0.50000, 10 = 0.35000, 100 = 0.23070, 500 = 0.17090, 1000 = 0.14527 (USD); RoHS: Yes; Mount: Surface Mount; Case/Package: 0603; Case Code (Metric): 1608; Case Code (Imperial): 0603; Min Operating Temperature: -55°C; Max Operating Temperature: 85°C; Packaging: Tape and Reel; Voltage Rating: 2.5V; Voltage Rating (DC): 2.5V; Dielectric: X5R; Length: 0.063inch; Width: 0.031inch; Thickness: 0.039inch; ComponentLink1URL: http://search.murata.co.jp/Ceramy/image/img/A01X/G101/ENG/GRM188R60E476ME15-01.pdf?src-supplier=Digi-Key; ComponentLink1Description: http://search.murata.co.jp/Ceramy/image/img/A01X/G101/ENG/GRM188R60E476ME15-01.pdf?src-supplier=Digi-Key; ComponentLink2URL: http://search.murata.co.jp/Ceramy/image/img/A01X/partnumbering_e_01.pdf?src-supplier=Digi-Key; ComponentLink2Description: http://search.murata.co.jp/Ceramy/image/img/A01X/partnumbering_e_01.pdf?src-supplier=Digi-Key; Supplier Part Number 1: 490-13245-1-ND
P14 P15 = 61300311121: CONN HEADER 3 POS 2.54; Manufacturer: Wurth Electronics; Number of Positions: 3; Gender: Male; Connector Type: Male Pin; Pitch: 0.1inch; Supplier 1: Digi-Key; Manufacturer Part Number: 61300311121; Stock 1: 175744; Mount: Through Hole; Contact Plating: Gold; Contact Material: Copper; Colour: Black; Number of Rows: 1; Packaging: Bulk; Termination: Solder; Number of Contacts: 3; Contact Mating Length: 0.236inch; REACH SVHC: Unknown; Lead Free: Lead Free; Supplier Part Number 1: 732-5316-ND
P16 = 61300211121: CONN HEADER 2 POS 2.54; Manufacturer: Wurth Electronics; Current Rating: 3A; Voltage Rating: 250V; Number of Positions: 2; Gender: Male; Connector Type: Male Pin; Pitch: 0.1inch; Supplier 1: Digi-Key; Manufacturer Part Number: 61300211121; Stock 1: 98753; Pricing 1: 1=0.13, 10=0.106, 25=0.088, 50=0.074, 100=0.067, 1000=0.061 (USD); Mount: Through Hole; Contact Plating: Gold; Housing Material: PBT; Contact Material: Copper,Copper Alloy; Colour: Black; Min Operating Temperature: -40°C; Max Operating Temperature: 125°C; Number of Rows: 1; Contact Gender: Male; Packaging: Bulk; Termination: Through Hole; Number of Contacts: 2; Contact Mating Length: 0.236inch; REACH SVHC: Unknown; Lead Free: Lead Free; ComponentLink1URL: https://datasheet.ciiva.com/13619/6130xx11121-48870-13619345.pdf; ComponentLink1Description: https://datasheet.ciiva.com/13619/6130xx11121-48870-13619345.pdf; Supplier Part Number 1: 732-5315-ND
R80 R82 = RNCP0603FTD10K0: as R25 on sheet [05] - ENERGY STORAGE AND PROTECTION; Supplier 1: Digi-Key; Manufacturer Part Number: RNCP0603FTD10K0; Stock 1: 579582; Pricing 1: 1 = 0.10000, 10 = 0.06700, 100 = 0.02730, 1000 = 0.01224, 2500 = 0.01063 (USD); RoHS: Yes; Mount: Surface Mount; Case/Package: 0603; Case Code (Metric): 1608; Case Code (Imperial): 0603; Contact Plating: Tin; Min Operating Temperature: -55°C; Max Operating Temperature: 155°C; Packaging: Tape and Reel; Tolerance: 1%; Composition: Thin Film; Number of Terminations: 2; Features: Moisture Resistant; Length: 0.059inch; Height: 0.02inch; Width: 0.031inch; Radiation Hardening: No; Lead Free: Lead Free; ComponentLink1URL: https://www.seielect.com/Catalog/SEI-rncp.pdf?src-supplier=Avnet; ComponentLink1Description: https://www.seielect.com/Catalog/SEI-rncp.pdf?src-supplier=Avnet; ComponentLink2URL: https://www.seielect.com/catalog/SEI-Packaging.pdf?src-supplier=Digi-Key; ComponentLink2Description: https://www.seielect.com/catalog/SEI-Packaging.pdf?src-supplier=Digi-Key; ComponentLink3URL: https://www.seielect.com/Catalog/SEI-rncp.pdf?src-supplier=Digi-Key; ComponentLink3Description: https://www.seielect.com/Catalog/SEI-rncp.pdf?src-supplier=Digi-Key; Supplier Part Number 1: RNCP0603FTD10K0CT-ND
R81 R83 = CRGCQ0603F330K: RES SMD 330K OHM 1% 1/10W 0603; Manufacturer: TE Connectivity; Supplier 1: Digi-Key; Manufacturer Part Number: CRGCQ0603F330K; Stock 1: 91633; Pricing 1: 1 = 0.10000, 10 = 0.03100, 100 = 0.01260, 1000 = 0.00568, 2500 = 0.00493 (USD); RoHS: No; ComponentLink1URL: https://www.te.com/commerce/DocumentDelivery/DDEController?Action=srchrtrv&DocNm=1773204-3&DocType=DS&DocLang=English&src-supplier=Digi-Key; ComponentLink1Description: https://www.te.com/commerce/DocumentDelivery/DDEController?Action=srchrtrv&DocNm=1773204-3&DocType=DS&DocLang=English&src-supplier=Digi-Key; ComponentLink2URL: https://www.te.com/commerce/DocumentDelivery/DDEController?Action=srchrtrv&amp;DocNm=1773204-3&amp;DocType=DS&amp;DocLang=English&src-supplier=Digi-Key; ComponentLink2Description: https://www.te.com/commerce/DocumentDelivery/DDEController?Action=srchrtrv&amp;DocNm=1773204-3&amp;DocType=DS&amp;DocLang=English&src-supplier=Digi-Key; Supplier Part Number 1: A129718CT-ND
U25 = 74AUP1G08SE-7: IC GATE AND 1CH 2-INP SOT-353; Manufacturer: Diodes; Min Supply Voltage: 800mV; Max Supply Voltage: 3.6V; Number of Inputs: 2; Propagation Delay: 6.2ns; Number of Outputs: 1; Quiescent Current: 500nA; High Level Output Current: 4mA; Supplier 1: Digi-Key; Manufacturer Part Number: 74AUP1G08SE-7; Stock 1: 896; Pricing 1: 1 = 0.43000, 10 = 0.37100, 100 = 0.27690, 500 = 0.21754, 1000 = 0.16810 (USD); RoHS: Yes; Mount: Surface Mount; Case/Package: SOT-353; Number of Pins: 5; Contact Plating: Tin; Min Operating Temperature: -40°C; Max Operating Temperature: 125°C; Logic Function: AND; Package Quantity: 3000; Packaging: Tape and Reel; Number of Circuits: 1; Low Level Output Current: 4mA; Number of Elements: 1; Radiation Hardening: No; REACH SVHC: No SVHC; Lead Free: Lead Free; ComponentLink1URL: https://datasheet.ciiva.com/12255/74aup1g08-219333-12255218.pdf?src-supplier=Mouser; ComponentLink1Description: https://datasheet.ciiva.com/12255/74aup1g08-219333-12255218.pdf?src-supplier=Mouser; ComponentLink2URL: https://datasheet.ciiva.com/15219/getdatasheetpartid-661118-15219698.pdf?src-supplier=Verical; ComponentLink2Description: https://datasheet.ciiva.com/15219/getdatasheetpartid-661118-15219698.pdf?src-supplier=Verical; ComponentLink3URL: https://datasheet.ciiva.com/6620/74aup1g08-6620571.pdf?src-supplier=Digi-Key; ComponentLink3Description: https://datasheet.ciiva.com/6620/74aup1g08-6620571.pdf?src-supplier=Digi-Key; ComponentLink4URL: https://datasheet.ciiva.com/6620/74aup1g08-6620573.pdf?src-supplier=Digi-Key; ComponentLink4Description: https://datasheet.ciiva.com/6620/74aup1g08-6620573.pdf?src-supplier=Digi-Key; ComponentLink5URL: https://datasheet.ciiva.com/6620/74aup1g08-6620575.pdf?src-supplier=Digi-Key; ComponentLink5Description: https://datasheet.ciiva.com/6620/74aup1g08-6620575.pdf?src-supplier=Digi-Key; Supplier Part Number 1: 74AUP1G08SE-7DICT-ND